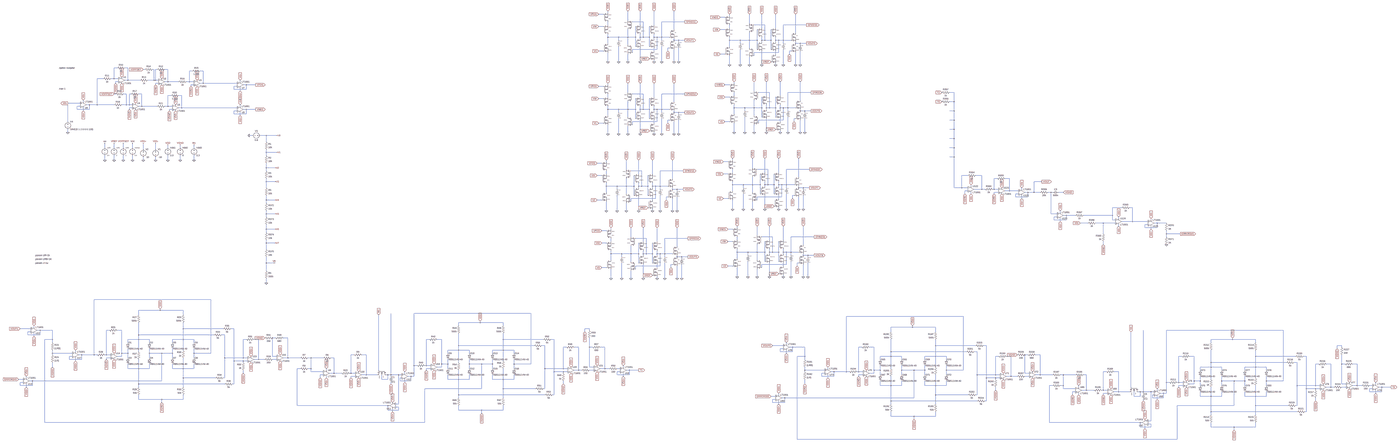
[diagram p0: schematic OZ_2_uniform_curves.asc, whole sheet]
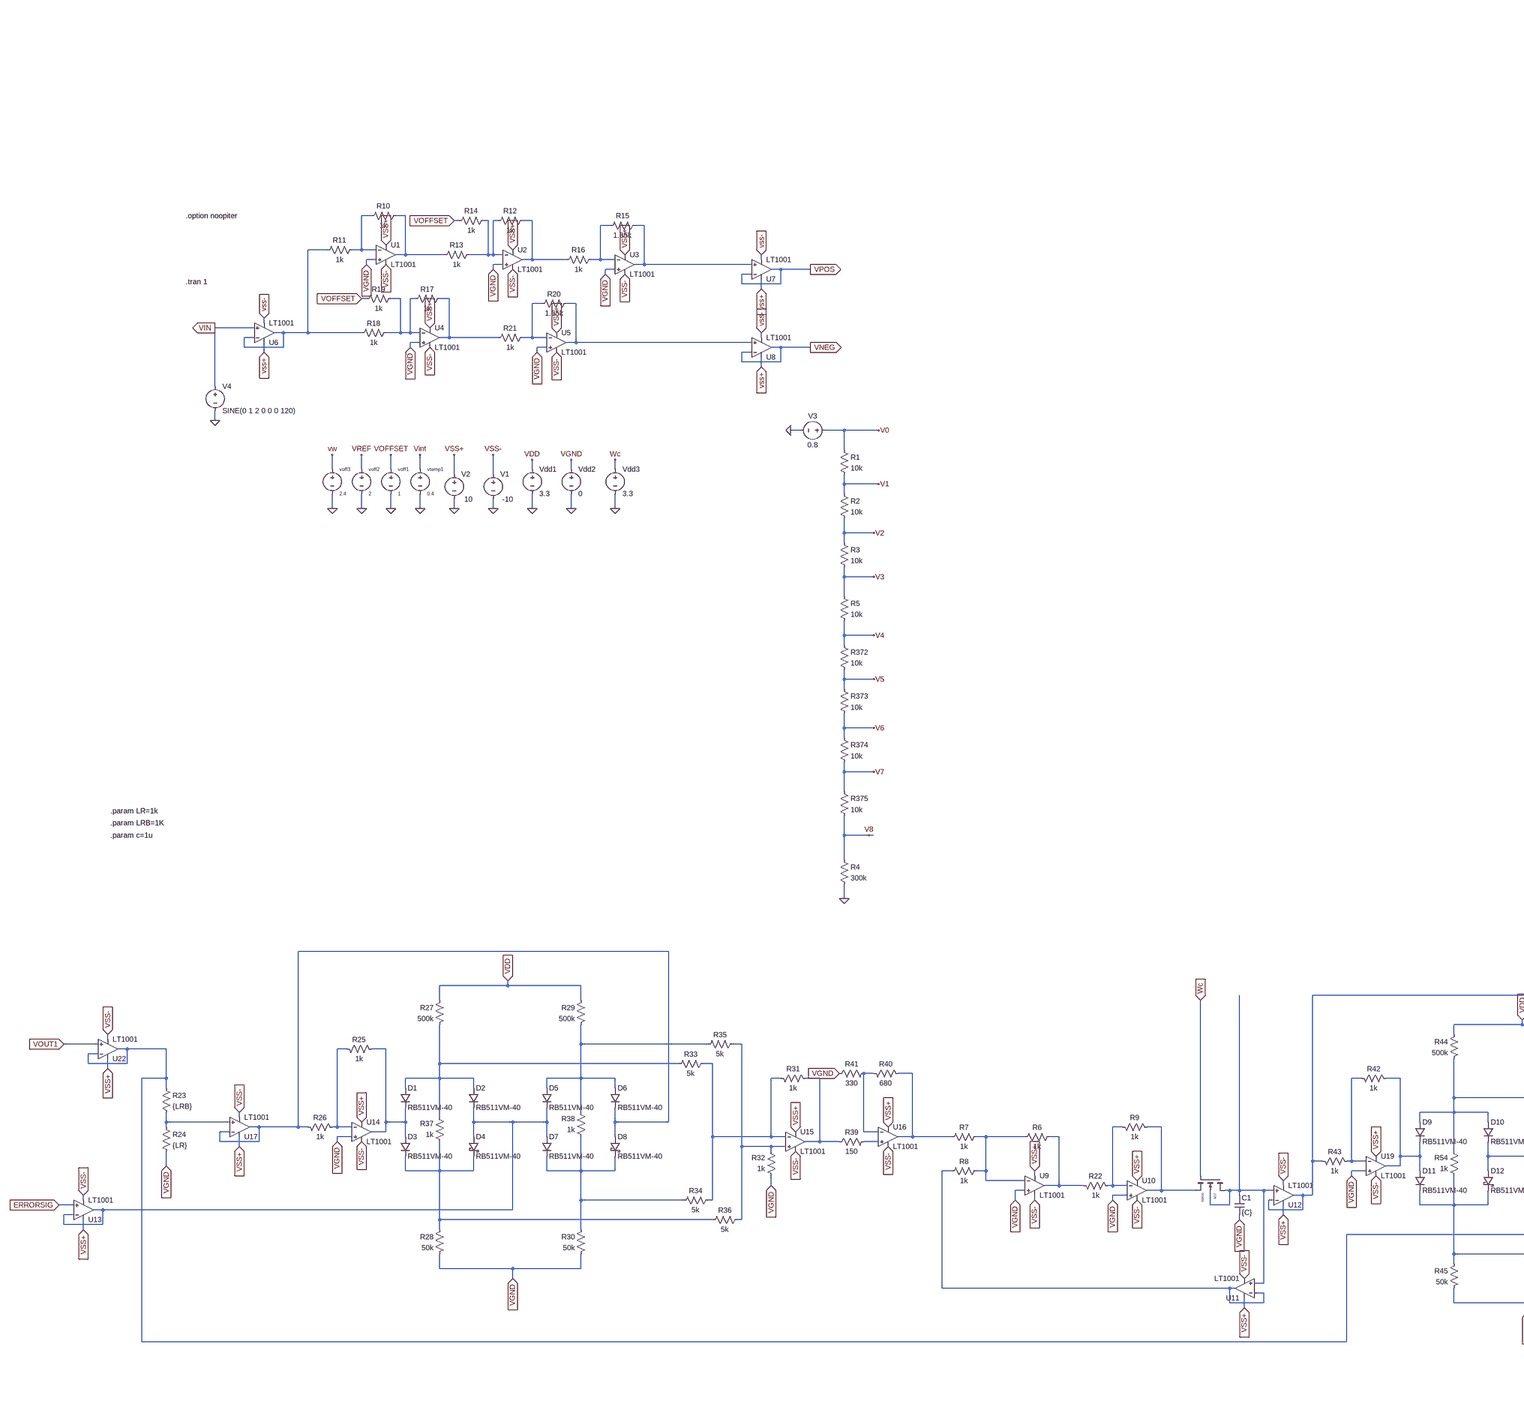
[diagram p1: schematic OZ_2_uniform_curves.asc, part, row 1 of 1, column 1 of 3]
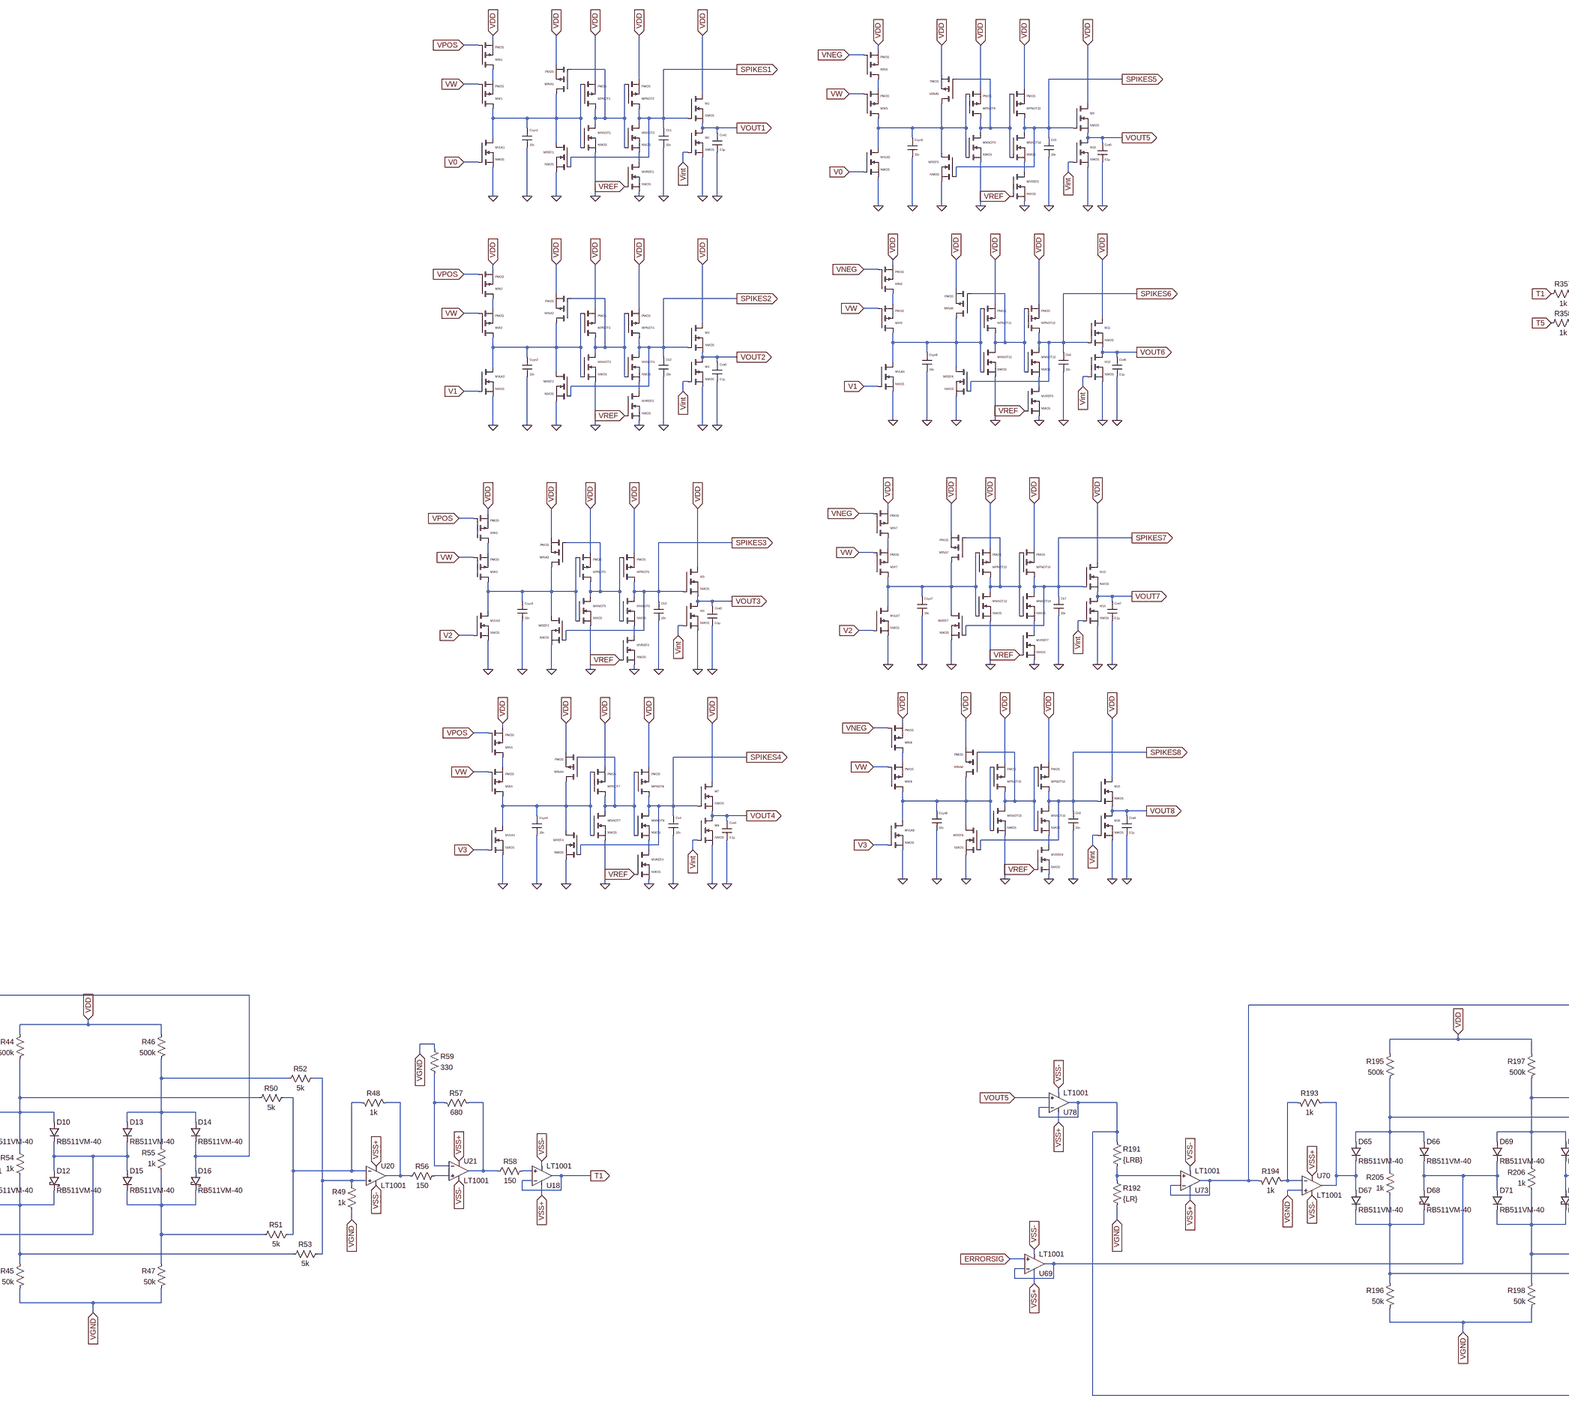
[diagram p2: schematic OZ_2_uniform_curves.asc, part, row 1 of 1, column 2 of 3]
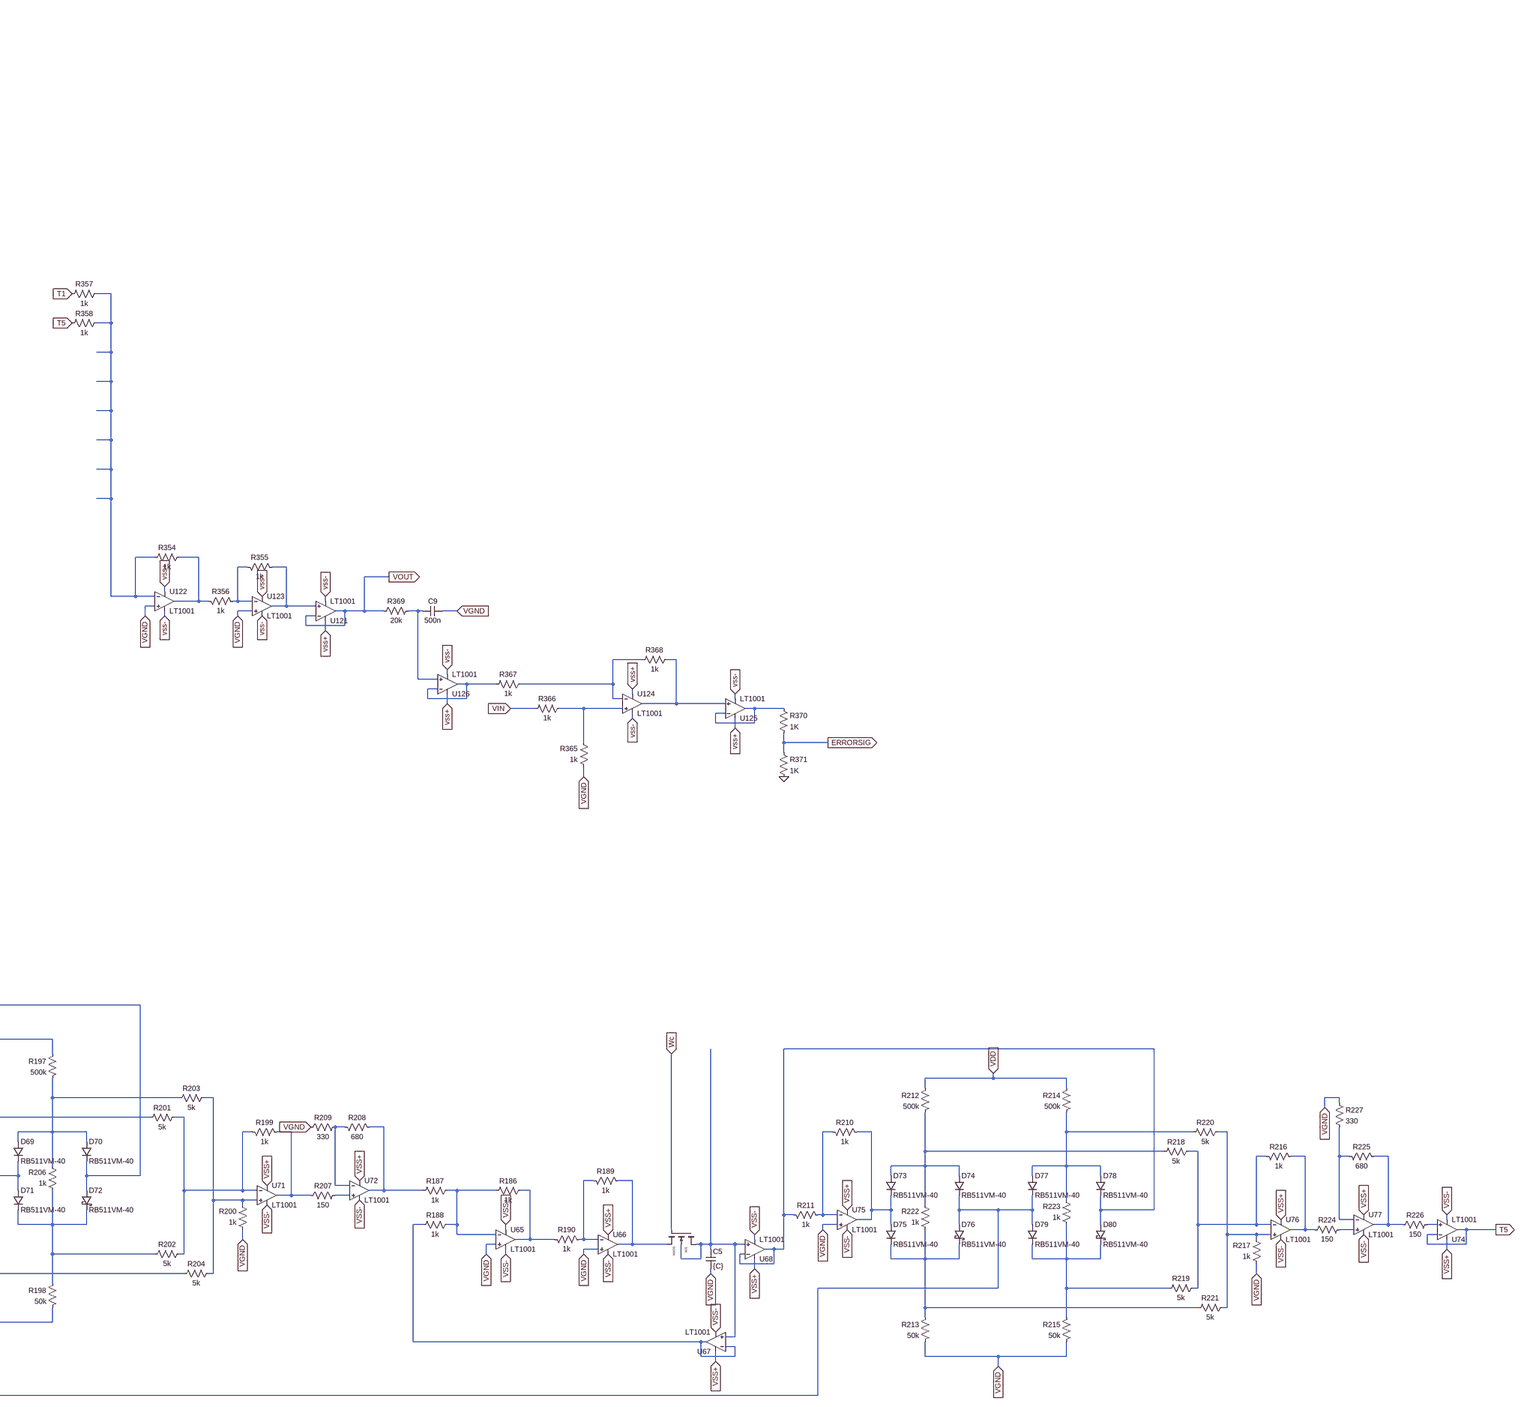
[diagram p3: schematic OZ_2_uniform_curves.asc, part, row 1 of 1, column 3 of 3]
* OZ_2_uniform_curves.asc
vtemp1 Vint 0 0.4
Vdd1 VDD 0 3.3
V1 VSS- 0 -10
V2 VSS+ 0 10
voff1 VOFFSET 0 1
voff2 VREF 0 2
voff3 vw 0 2.4
Vdd2 VGND 0 0
XU1 VGND N009 VSS+ VSS- N010 LT1001  ; pins In+ In- V+ V- OUT
R10 N010 N009 1k
R11 N009 N015 1k
XU2 VGND N011 VSS+ VSS- N012 LT1001  ; pins In+ In- V+ V- OUT
R12 N012 N011 1k
R13 N011 N010 1k
R14 N011 VOFFSET 1k
XU3 VGND N013 VSS+ VSS- N014 LT1001  ; pins In+ In- V+ V- OUT
R15 N014 N013 1.65k
R16 N013 N012 1k
XU4 VGND N018 VSS+ VSS- N019 LT1001  ; pins In+ In- V+ V- OUT
R17 N019 N018 1k
R18 N018 N015 1k
R19 N018 VOFFSET 1k
XU5 VGND N021 VSS+ VSS- N022 LT1001  ; pins In+ In- V+ V- OUT
R20 N022 N021 1.65k
R21 N021 N019 1k
XU6 VIN N015 VSS+ VSS- N015 LT1001  ; pins In+ In- V+ V- OUT
XU7 N014 VPOS VSS+ VSS- VPOS LT1001  ; pins In+ In- V+ V- OUT
XU8 N022 VNEG VSS+ VSS- VNEG LT1001  ; pins In+ In- V+ V- OUT
MW1 N005 vw N002 N002 PMOS
Csyn1 N005 0 10n V=4 Irms=162m Rser=0.395426 Lser=0 mfg="KEMET" pn="C0402C103K7PAC" type="X5R" IC=0
Ck1 SPIKES1 0 10n
MPNOT1 N001 N005 VDD VDD PMOS
MNNOT1 N001 N005 0 0 NMOS
MVREF1 N007 VREF 0 0 NMOS
MREF1 N005 SPIKES1 0 0 NMOS
MVLK1 N005 V0 0 0 NMOS
MINA1 N005 N001 VDD VDD PMOS
MIN1 N002 VPOS VDD VDD PMOS
MPNOT2 SPIKES1 N001 VDD VDD PMOS
MNNOT2 SPIKES1 N001 N007 N007 NMOS
M1 VDD SPIKES1 VOUT1 VOUT1 NMOS
M2 VOUT1 Vint 0 0 NMOS
Cint1 VOUT1 0 0.1µ
MW2 N026 vw N024 N024 PMOS
Csyn2 N026 0 10n V=4 Irms=162m Rser=0.395426 Lser=0 mfg="KEMET" pn="C0402C103K7PAC" type="X5R" IC=0
Ck2 SPIKES2 0 10n
MPNOT3 N020 N026 VDD VDD PMOS
MNNOT3 N020 N026 0 0 NMOS
MVREF2 N028 VREF 0 0 NMOS
MREF2 N026 SPIKES2 0 0 NMOS
MVLK2 N026 V1 0 0 NMOS
MINA2 N026 N020 VDD VDD PMOS
MIN2 N024 VPOS VDD VDD PMOS
MPNOT4 SPIKES2 N020 VDD VDD PMOS
MNNOT4 SPIKES2 N020 N028 N028 NMOS
M3 VDD SPIKES2 VOUT2 VOUT2 NMOS
M4 VOUT2 Vint 0 0 NMOS
Cint2 VOUT2 0 0.1µ
MW3 N037 vw N032 N032 PMOS
Csyn3 N037 0 10n V=4 Irms=162m Rser=0.395426 Lser=0 mfg="KEMET" pn="C0402C103K7PAC" type="X5R" IC=0
Ck3 SPIKES3 0 10n
MPNOT5 N030 N037 VDD VDD PMOS
MNNOT5 N030 N037 0 0 NMOS
MVREF3 N040 VREF 0 0 NMOS
MREF3 N037 SPIKES3 0 0 NMOS
MVLK3 N037 V2 0 0 NMOS
MINA3 N037 N030 VDD VDD PMOS
MIN3 N032 VPOS VDD VDD PMOS
MPNOT6 SPIKES3 N030 VDD VDD PMOS
MNNOT6 SPIKES3 N030 N040 N040 NMOS
M5 VDD SPIKES3 VOUT3 VOUT3 NMOS
M6 VOUT3 Vint 0 0 NMOS
Cint3 VOUT3 0 0.1µ
MW4 N051 vw N049 N049 PMOS
Csyn4 N051 0 10n V=4 Irms=162m Rser=0.395426 Lser=0 mfg="KEMET" pn="C0402C103K7PAC" type="X5R" IC=0
Ck4 SPIKES4 0 10n
MPNOT7 N047 N051 VDD VDD PMOS
MNNOT7 N047 N051 0 0 NMOS
MVREF4 N053 VREF 0 0 NMOS
MREF4 N051 SPIKES4 0 0 NMOS
MVLK4 N051 V3 0 0 NMOS
MINA4 N051 N047 VDD VDD PMOS
MIN4 N049 VPOS VDD VDD PMOS
MPNOT8 SPIKES4 N047 VDD VDD PMOS
MNNOT8 SPIKES4 N047 N053 N053 NMOS
M7 VDD SPIKES4 VOUT4 VOUT4 NMOS
M8 VOUT4 Vint 0 0 NMOS
Cint4 VOUT4 0 0.1µ
MW5 N006 vw N004 N004 PMOS
Csyn5 N006 0 10n V=4 Irms=162m Rser=0.395426 Lser=0 mfg="KEMET" pn="C0402C103K7PAC" type="X5R" IC=0
Ck5 SPIKES5 0 10n
MPNOT9 N003 N006 VDD VDD PMOS
MNNOT9 N003 N006 0 0 NMOS
MVREF5 N008 VREF 0 0 NMOS
MREF5 N006 SPIKES5 0 0 NMOS
MVLK5 N006 V0 0 0 NMOS
MINA5 N006 N003 VDD VDD PMOS
MIN5 N004 VNEG VDD VDD PMOS
MPNOT10 SPIKES5 N003 VDD VDD PMOS
MNNOT10 SPIKES5 N003 N008 N008 NMOS
M9 VDD SPIKES5 VOUT5 VOUT5 NMOS
M10 VOUT5 Vint 0 0 NMOS
Cint5 VOUT5 0 0.1µ
MW6 N025 vw N023 N023 PMOS
Csyn6 N025 0 10n V=4 Irms=162m Rser=0.395426 Lser=0 mfg="KEMET" pn="C0402C103K7PAC" type="X5R" IC=0
Ck6 SPIKES6 0 10n
MPNOT11 N016 N025 VDD VDD PMOS
MNNOT11 N016 N025 0 0 NMOS
MVREF6 N027 VREF 0 0 NMOS
MREF6 N025 SPIKES6 0 0 NMOS
MVLK6 N025 V1 0 0 NMOS
MINA6 N025 N016 VDD VDD PMOS
MIN6 N023 VNEG VDD VDD PMOS
MPNOT12 SPIKES6 N016 VDD VDD PMOS
MNNOT12 SPIKES6 N016 N027 N027 NMOS
M11 VDD SPIKES6 VOUT6 VOUT6 NMOS
M12 VOUT6 Vint 0 0 NMOS
Cint6 VOUT6 0 0.1µ
MW7 N036 vw N031 N031 PMOS
Csyn7 N036 0 10n V=4 Irms=162m Rser=0.395426 Lser=0 mfg="KEMET" pn="C0402C103K7PAC" type="X5R" IC=0
Ck7 SPIKES7 0 10n
MPNOT13 N029 N036 VDD VDD PMOS
MNNOT13 N029 N036 0 0 NMOS
MVREF7 N039 VREF 0 0 NMOS
MREF7 N036 SPIKES7 0 0 NMOS
MVLK7 N036 V2 0 0 NMOS
MINA7 N036 N029 VDD VDD PMOS
MIN7 N031 VNEG VDD VDD PMOS
MPNOT14 SPIKES7 N029 VDD VDD PMOS
MNNOT14 SPIKES7 N029 N039 N039 NMOS
M13 VDD SPIKES7 VOUT7 VOUT7 NMOS
M14 VOUT7 Vint 0 0 NMOS
Cint7 VOUT7 0 0.1µ
MW8 N050 vw N048 N048 PMOS
Csyn8 N050 0 10n V=4 Irms=162m Rser=0.395426 Lser=0 mfg="KEMET" pn="C0402C103K7PAC" type="X5R" IC=0
Ck8 SPIKES8 0 10n
MPNOT15 N046 N050 VDD VDD PMOS
MNNOT15 N046 N050 0 0 NMOS
MVREF8 N052 VREF 0 0 NMOS
MREF8 N050 SPIKES8 0 0 NMOS
MVLK8 N050 V3 0 0 NMOS
MINA8 N050 N046 VDD VDD PMOS
MIN8 N048 VNEG VDD VDD PMOS
MPNOT16 SPIKES8 N046 VDD VDD PMOS
MNNOT16 SPIKES8 N046 N052 N052 NMOS
M15 VDD SPIKES8 VOUT8 VOUT8 NMOS
M16 VOUT8 Vint 0 0 NMOS
Cint8 VOUT8 0 0.1µ
V4 VIN 0 SINE(0 1 2 0 0 0 120)
XU121 N035 VOUT VSS+ VSS- VOUT LT1001  ; pins In+ In- V+ V- OUT
XU122 VGND N017 VSS+ VSS- N033 LT1001  ; pins In+ In- V+ V- OUT
R354 N033 N017 1k
XU123 VGND N034 VSS+ VSS- N035 LT1001  ; pins In+ In- V+ V- OUT
R355 N034 N035 1k
R356 N033 N034 1k
R357 N017 T1 1k
R358 N017 T5 1k
M17 N112 Wc N087 N112 NMOS
C1 N112 VGND {C} IC=0
XU9 VGND N095 VSS+ VSS- N096 LT1001  ; pins In+ In- V+ V- OUT
R6 N096 N095 1k
R7 N095 N066 1k
R8 N095 N105 1k
XU10 VGND N086 VSS+ VSS- N087 LT1001  ; pins In+ In- V+ V- OUT
R9 N086 N087 1k
R22 N096 N086 1k
XU11 N112 N105 VSS+ VSS- N105 LT1001  ; pins In+ In- V+ V- OUT
XU12 N112 N055 VSS+ VSS- N055 LT1001  ; pins In+ In- V+ V- OUT
R23 N059 N084 {LRB}
R24 N084 VGND {LR}
XU13 ERRORSIG N085 VSS+ VSS- N085 LT1001  ; pins In+ In- V+ V- OUT
D1 N063 N061 RB511VM-40
XU14 VGND N060 VSS+ VSS- N061 LT1001  ; pins In+ In- V+ V- OUT
R25 N060 N061 1k
R26 N054 N060 1k
D2 N063 N085 RB511VM-40
D3 N061 N103 RB511VM-40
D4 N085 N103 RB511VM-40
R27 VDD N063 500k
R28 N103 VGND 50k
D5 N057 N085 RB511VM-40
D6 N057 N054 RB511VM-40
D7 N085 N104 RB511VM-40
D8 N054 N104 RB511VM-40
R29 VDD N057 500k
R30 N104 VGND 50k
XU15 N058 N064 VSS+ VSS- N067 LT1001  ; pins In+ In- V+ V- OUT
R31 N064 N067 1k
R32 VGND N058 1k
R33 N064 N063 5k
R34 N064 N104 5k
R35 N058 N057 5k
R36 N058 N103 5k
R37 N103 N063 1k
R38 N104 N057 1k
R39 N067 N097 150
XU16 N097 N065 VSS+ VSS- N066 LT1001  ; pins In+ In- V+ V- OUT
R40 N065 N066 680
R41 VGND N065 330
XU17 N084 N054 VSS+ VSS- N054 LT1001  ; pins In+ In- V+ V- OUT
XU18 N106 T1 VSS+ VSS- T1 LT1001  ; pins In+ In- V+ V- OUT
D9 N072 N069 RB511VM-40
XU19 VGND N068 VSS+ VSS- N069 LT1001  ; pins In+ In- V+ V- OUT
R42 N068 N069 1k
R43 N055 N068 1k
D10 N072 N059 RB511VM-40
D11 N069 N116 RB511VM-40
D12 N059 N116 RB511VM-40
R44 VDD N072 500k
R45 N116 VGND 50k
D13 N070 N059 RB511VM-40
D14 N070 N055 RB511VM-40
D15 N059 N117 RB511VM-40
D16 N055 N117 RB511VM-40
R46 VDD N070 500k
R47 N117 VGND 50k
XU20 N071 N073 VSS+ VSS- N076 LT1001  ; pins In+ In- V+ V- OUT
R48 N073 N076 1k
R49 VGND N071 1k
R50 N073 N072 5k
R51 N073 N117 5k
R52 N071 N070 5k
R53 N071 N116 5k
R54 N116 N072 1k
R55 N117 N070 1k
R56 N076 N107 150
XU21 N107 N077 VSS+ VSS- N078 LT1001  ; pins In+ In- V+ V- OUT
R57 N077 N078 680
R58 N078 N106 150
R59 VGND N077 330
XU22 VOUT1 N059 VSS+ VSS- N059 LT1001  ; pins In+ In- V+ V- OUT
M21 N123 Wc N111 N123 NMOS
C5 N123 VGND {C} IC=0
XU65 VGND N113 VSS+ VSS- N114 LT1001  ; pins In+ In- V+ V- OUT
R186 N114 N113 1k
R187 N113 N089 1k
R188 N113 N120 1k
XU66 VGND N110 VSS+ VSS- N111 LT1001  ; pins In+ In- V+ V- OUT
R189 N110 N111 1k
R190 N114 N110 1k
XU67 N123 N120 VSS+ VSS- N120 LT1001  ; pins In+ In- V+ V- OUT
XU68 N123 N062 VSS+ VSS- N062 LT1001  ; pins In+ In- V+ V- OUT
R191 N079 N108 {LRB}
R192 N108 VGND {LR}
XU69 ERRORSIG N109 VSS+ VSS- N109 LT1001  ; pins In+ In- V+ V- OUT
D65 N082 N081 RB511VM-40
XU70 VGND N080 VSS+ VSS- N081 LT1001  ; pins In+ In- V+ V- OUT
R193 N080 N081 1k
R194 N056 N080 1k
D66 N082 N109 RB511VM-40
D67 N081 N118 RB511VM-40
D68 N109 N118 RB511VM-40
R195 VDD N082 500k
R196 N118 VGND 50k
D69 N074 N109 RB511VM-40
D70 N074 N056 RB511VM-40
D71 N109 N119 RB511VM-40
D72 N056 N119 RB511VM-40
R197 VDD N074 500k
R198 N119 VGND 50k
XU71 N075 N083 VSS+ VSS- N090 LT1001  ; pins In+ In- V+ V- OUT
R199 N083 N090 1k
R200 VGND N075 1k
R201 N083 N082 5k
R202 N083 N119 5k
R203 N075 N074 5k
R204 N075 N118 5k
R205 N118 N082 1k
R206 N119 N074 1k
R207 N090 N115 150
XU72 N115 N088 VSS+ VSS- N089 LT1001  ; pins In+ In- V+ V- OUT
R208 N088 N089 680
R209 VGND N088 330
XU73 N108 N056 VSS+ VSS- N056 LT1001  ; pins In+ In- V+ V- OUT
XU74 N121 T5 VSS+ VSS- T5 LT1001  ; pins In+ In- V+ V- OUT
D73 N098 N092 RB511VM-40
XU75 VGND N091 VSS+ VSS- N092 LT1001  ; pins In+ In- V+ V- OUT
R210 N091 N092 1k
R211 N062 N091 1k
D74 N098 N079 RB511VM-40
D75 N092 N124 RB511VM-40
D76 N079 N124 RB511VM-40
R212 VDD N098 500k
R213 N124 VGND 50k
D77 N093 N079 RB511VM-40
D78 N093 N062 RB511VM-40
D79 N079 N125 RB511VM-40
D80 N062 N125 RB511VM-40
R214 VDD N093 500k
R215 N125 VGND 50k
XU76 N094 N099 VSS+ VSS- N100 LT1001  ; pins In+ In- V+ V- OUT
R216 N099 N100 1k
R217 VGND N094 1k
R218 N099 N098 5k
R219 N099 N125 5k
R220 N094 N093 5k
R221 N094 N124 5k
R222 N124 N098 1k
R223 N125 N093 1k
R224 N100 N122 150
XU77 N122 N101 VSS+ VSS- N102 LT1001  ; pins In+ In- V+ V- OUT
R225 N101 N102 680
R226 N102 N121 150
R227 VGND N101 330
XU78 VOUT5 N079 VSS+ VSS- N079 LT1001  ; pins In+ In- V+ V- OUT
XU124 N044 N041 VSS+ VSS- N042 LT1001  ; pins In+ In- V+ V- OUT
R365 VGND N044 1k
R366 N044 VIN 1k
R367 N041 N043 1k
R368 N042 N041 1k
XU125 N042 N045 VSS+ VSS- N045 LT1001  ; pins In+ In- V+ V- OUT
R369 VOUT N038 20k
C9 N038 VGND 500n
XU126 N038 N043 VSS+ VSS- N043 LT1001  ; pins In+ In- V+ V- OUT
R370 N045 ERRORSIG 1K
R371 ERRORSIG 0 1K
Vdd3 Wc 0 3.3
V3 V0 0 0.8
R1 V0 V1 10k
R2 V1 V2 10k
R3 V2 V3 10k
R4 V8 0 300k
R5 V3 V4 10k
R372 V4 V5 10k
R373 V5 V6 10k
R374 V6 V7 10k
R375 V7 V8 10k
.model D D
.lib standard.dio
.model NMOS NMOS
.model PMOS PMOS
.lib standard.mos
.tran 1
.option noopiter
.param LR=1k
.param LRB=1K
.param c=1u
.lib LTC.lib
.backanno
.end